# Altium schematic sheet Sheet_CL-RMS-01.SchDoc: ~RMS
size A4; Author: Canaan Lv; DocumentNumber: CL-RMS-01; Revision: v1.3
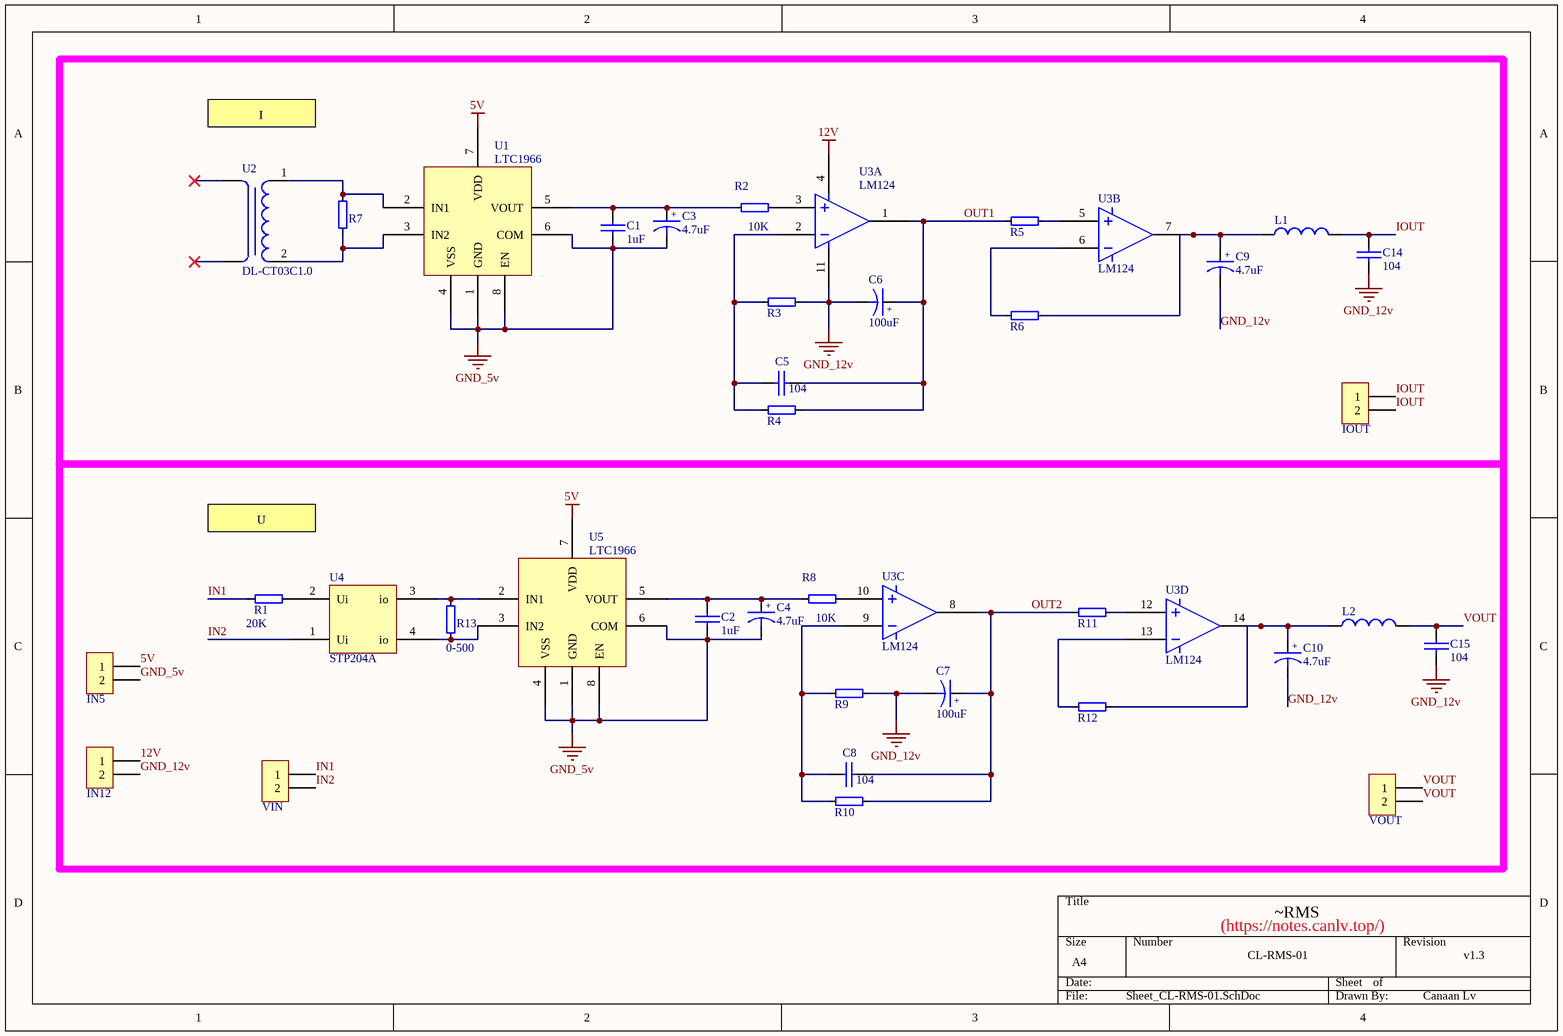
[diagram p0: Sheet_CL-RMS-01.SchDoc]

## Parts
C1  普通电容  [C0805]  (value not drawn)
C2  普通电容  [C0805]  (value not drawn)
C3  电解电容  [CZ0.50/25V47U]  (value not drawn)
C4  电解电容  [CZ0.50/25V47U]  (value not drawn)
C5  普通电容  [C0805]  (value not drawn)
C6  电解电容  [CZ0.50/25V47U]  (value not drawn)
C7  电解电容  [CZ0.50/25V47U]  (value not drawn)
C8  普通电容  [C0805]  (value not drawn)
C9  电解电容  [CZ0.50/25V47U]  (value not drawn)
C10  电解电容  [CZ0.50/25V47U]  (value not drawn)
C14  普通电容  [C0805]  (value not drawn)
C15  普通电容  [C0805]  (value not drawn)
IN5  CON2  [P2]  (value not drawn)
IN12  CON2  [P2]  (value not drawn)
IOUT  CON2  [P2]  (value not drawn)
L1  (no value)  [L1206]
L2  (no value)  [L1206]
R1  RES  [W1]  (value not drawn)
R2  RES  [C0805]  (value not drawn)
R3  RES  [C0805]  (value not drawn)
R4  RES  [W1]  (value not drawn)
R5  RES  [C0805]  (value not drawn)
R6  RES  [C0805]  (value not drawn)
R7  RES  [W1]  (value not drawn)
R8  RES  [C0805]  (value not drawn)
R9  RES  [C0805]  (value not drawn)
R10  RES  [W1]  (value not drawn)
R11  RES  [C0805]  (value not drawn)
R12  RES  [C0805]  (value not drawn)
R13  RES  [W1]  (value not drawn)
U1  LTC1966  [LTC1966]
U2  DL-CT03C1.0  [DL-CT03C1.0]
U3  LM124  [DIP-14]  (parts A,B,C,D of 4)
U4  STP204A  [STP204A]
U5  LTC1966  [LTC1966]
VIN  CON2  [P2]  (value not drawn)
VOUT  CON2  [P2]  (value not drawn)

## Nets
5V: IN5.1 U1.7(VDD) U5.7(VDD)
12V: IN12.1 U3.4
GND_5v: C1.2 C2.2 C3.2 C4.2 IN5.2 U1.1(GND) U1.4(VSS) U1.6(COM) U1.8(EN) U5.1(GND) U5.4(VSS) U5.6(COM) U5.8(EN)
GND_12v: C6.2 C7.2 C9.2 C10.2 C14.1 C15.1 IN12.2 R3.2 R9.2 U3.11
IN1: R1.1 VIN.1
IN2: U4.1(Ui) VIN.2
IOUT: C14.2 IOUT.1 IOUT.2 L1.2
OUT1: C5.2 C6.1 R4.2 R5.1 U3.1
OUT2: C7.1 C8.2 R10.2 R11.1 U3.8
VOUT: C15.2 L2.2 VOUT.1 VOUT.2
NetC1_1: C1.1 C3.1 R2.1 U1.5(VOUT)
NetC2_1: C2.1 C4.1 R8.1 U5.5(VOUT)
NetC5_1: C5.1 R3.1 R4.1 U3.2
NetC8_1: C8.1 R9.1 R10.1 U3.9
NetC9_1: C9.1 L1.1 R6.2 U3.7
NetC10_1: C10.1 L2.1 R12.2 U3.14
NetR1_2: R1.2 U4.2(Ui)
NetR2_2: R2.2 U3.3
NetR5_2: R5.2 U3.5
NetR6_1: R6.1 U3.6
NetR7_1: R7.1 U1.3(IN2) U2.2
NetR7_2: R7.2 U1.2(IN1) U2.1
NetR8_2: R8.2 U3.10
NetR11_2: R11.2 U3.12
NetR12_1: R12.1 U3.13
NetR13_1: R13.1 U4.4(io) U5.3(IN2)
NetR13_2: R13.2 U4.3(io) U5.2(IN1)

Not connected (* = marked no-connect by the designer): U2 0*

## Notes on the sheet
- I
- U
- (https://notes.canlv.top/)
- (in symbol RES) 10K; 20K; 0-500
- (in symbol 普通电容) 1uF; 104
- (in symbol 电解电容) +; 4.7uF; 100uF

## Library data of the parts
C1 C2 C5 C8 C14 C15 = 普通电容: Capacitor
C3 C4 C6 C7 C9 C10 = 电解电容: Capacitor
IN5 IN12 IOUT VIN VOUT = CON2: Connector
L1 L2 = 贴片电感